# EAGLE design LED_Board (EAGLE 7.6.0)
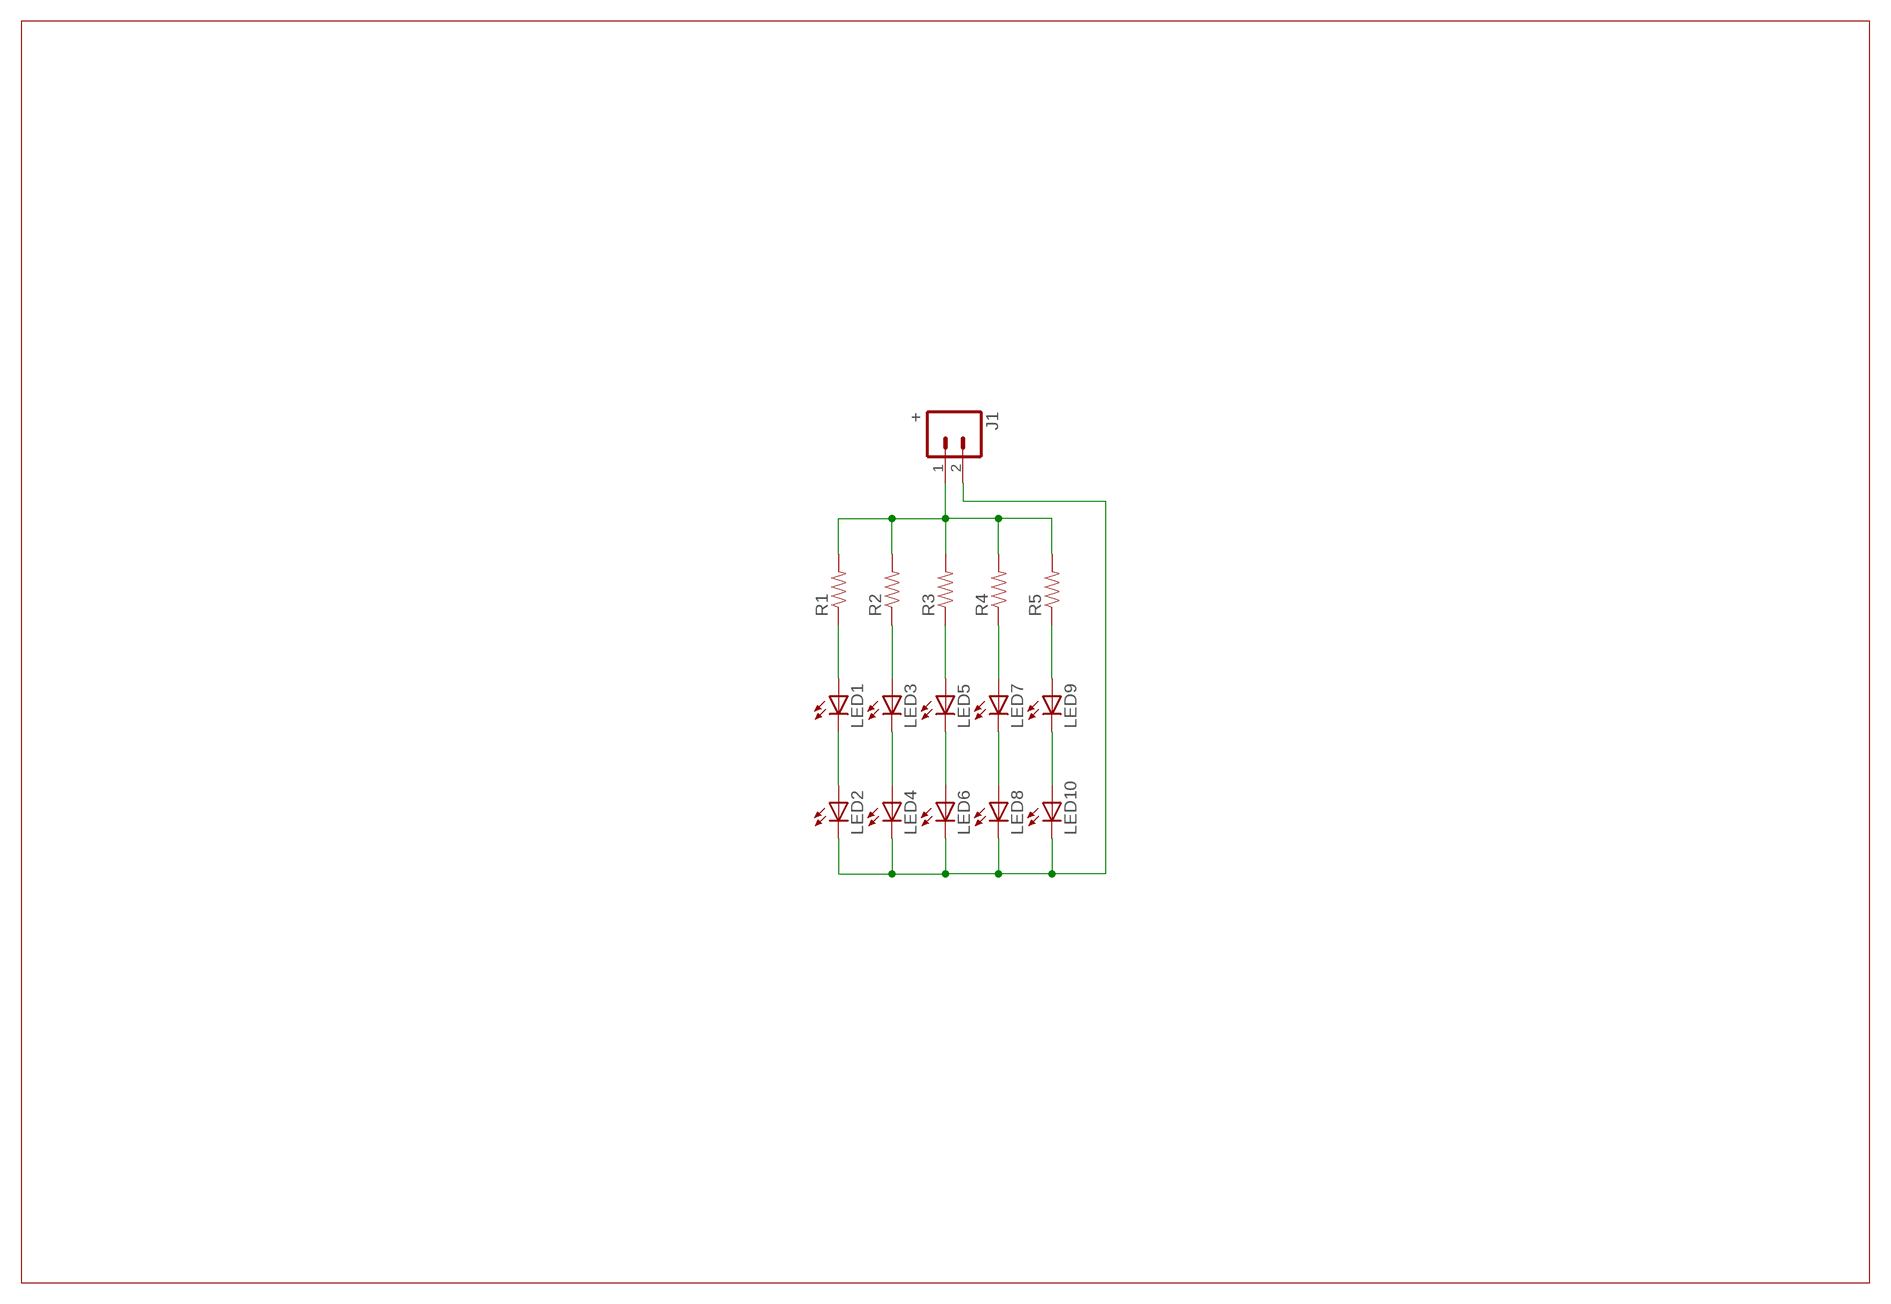
[diagram p0: schematic, sheet 1]

## Parts
J1  +  M02LOCK  [1X02_LOCK]
LED1  LED5MM  [LED5MM]
LED2  LED5MM  [LED5MM]
LED3  LED5MM  [LED5MM]
LED4  LED5MM  [LED5MM]
LED5  LED5MM  [LED5MM]
LED6  LED5MM  [LED5MM]
LED7  LED5MM  [LED5MM]
LED8  LED5MM  [LED5MM]
LED9  LED5MM  [LED5MM]
LED10  LED5MM  [LED5MM]
R1  RESISTOR1206  [1206]
R2  RESISTOR1206  [1206]
R3  RESISTOR1206  [1206]
R4  RESISTOR1206  [1206]
R5  RESISTOR1206  [1206]

## Nets
GND: J1.2 LED2.K(C) LED4.K(C) LED6.K(C) LED8.K(C) LED10.K(C)
N$1: J1.1 R1.2 R2.2 R3.2 R4.2 R5.2
N$4: LED9.A R5.1
N$5: LED7.A R4.1
N$6: LED5.A R3.1
N$7: LED3.A R2.1
N$8: LED1.A R1.1
N$9: LED1.K(C) LED2.A
N$10: LED3.K(C) LED4.A
N$11: LED5.K(C) LED6.A
N$12: LED7.K(C) LED8.A
N$13: LED9.K(C) LED10.A

## Library data of the parts
J1 = Connectors:M02: Standard 2-pin 0.1" header. Use with - straight break away headers ( PRT-00116) - right angle break away headers (PRT-00553) - swiss pins (PRT-00743) - machine pins (PRT-00117) - female headers (PRT-00115) Molex polarized connector foot print use with: PRT-08233 with associated crimp pins and housings. 2.54_SCREWTERM for use with PRT-10571. 3.5mm Screw Terminal footprints for PRT-08084 5mm Screw Terminal footprints for use with PRT-08432
LED1-LED10 = led:LED: LED OSRAM: - CHIPLED LG R971, LG N971, LY N971, LG Q971, LY Q971, LO R971, LY R971 LH N974, LH R974 LS Q976, LO Q976, LY Q976 LO Q996 - Hyper CHIPLED LW Q18S LB Q993, LB Q99A, LB R99A - SideLED LS A670, LO A670, LY A670, LG A670, LP A670 LB A673, LV A673, LT A673, LW A673 LH A674 LY A675 LS A676, LA A676, LO A676, LY A676, LW A676 LS A679, LY A679, LG A679 - Hyper Micro SIDELED® LS Y876, LA Y876, LO Y876, LY Y876 LT Y87S - SmartLED LW L88C, LW L88S LB L89C, LB L89S, LG L890 LS L89K, LO L89K, LY L89K LS L896, LA L896, LO L896, LY L896 - TOPLED LS T670, LO T670, LY T670, LG T670, LP T670 LSG T670, LSP T670, LSY T670, LOP T670, LYG T670 LG T671, LOG T671, LSG T671 LB T673, LV T673, LT T673, LW T673 LH T674 LS T676, LA T676, LO T676, LY T676, LB T676, LH T676, LSB T676, LW T676 LB T67C, LV T67C, LT T67C, LS T67K, LO T67K, LY T67K, LW E67C LS E67B, LA E67B, LO E67B, LY E67B, LB E67C, LV E67C, LT E67C LW T67C LS T679, LY T679, LG T679 LS T770, LO T770, LY T770, LG T770, LP T770 LB T773, LV T773, LT T773, LW T773 LH T774 LS E675, LA E675, LY E675, LS T675 LS T776, LA T776, LO T776, LY T776, LB T776 LHGB T686 LT T68C, LB T68C - Hyper Mini TOPLED® LB M676 - Mini TOPLED Santana® LG M470 LS M47K, LO M47K, LY M47K Source: http://www.osram.convergy.de LUXEON: - LUMILED® LXK2-PW12-R00, LXK2-PW12-S00, LXK2-PW14-U00, LXK2-PW14-V00 LXK2-PM12-R00, LXK2-PM12-S00, LXK2-PM14-U00 LXK2-PE12-Q00, LXK2-PE12-R00, LXK2-PE12-S00, LXK2-PE14-T00, LXK2-PE14-U00 LXK2-PB12-K00, LXK2-PB12-L00, LXK2-PB12-M00, LXK2-PB14-N00, LXK2-PB14-P00, LXK2-PB14-Q00 LXK2-PR12-L00, LXK2-PR12-M00, LXK2-PR14-Q00, LXK2-PR14-R00 LXK2-PD12-Q00, LXK2-PD12-R00, LXK2-PD12-S00 LXK2-PH12-R00, LXK2-PH12-S00 LXK2-PL12-P00, LXK2-PL12-Q00, LXK2-PL12-R00 Source: www.luxeon.com KINGBRIGHT: KA-3528ASYC Source: www.kingbright.com
R1-R5 = Passives:RESISTOR: Resistor Basic schematic elements and footprints for 0603, 1206, and PTH resistors.

## Board
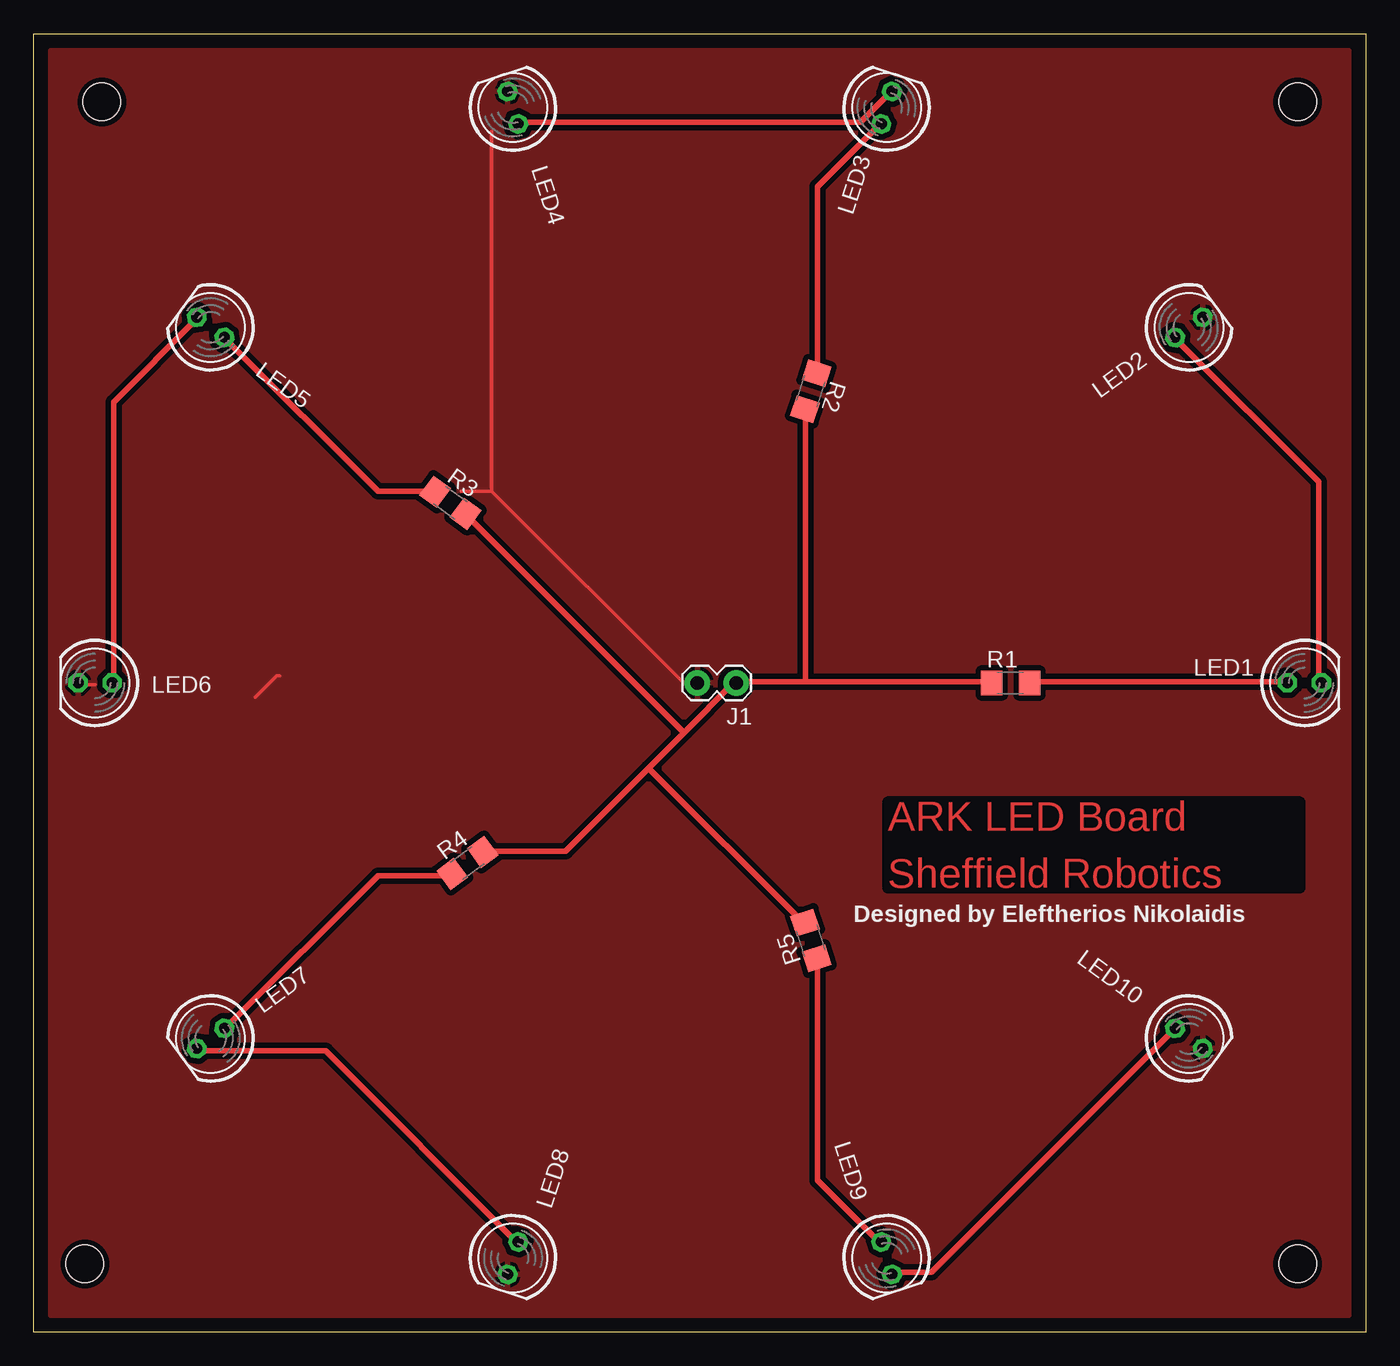
[diagram p1: board, top side]

Size 99.06 x 96.52 mm. Coordinates in mm from the lower left corner, seen from the top.
Outline: 0,96.52 99.06,96.52 99.06,0 0,0 0,96.52
Copper layers (1*16): Top 0.035mm / dielectric 1.5mm / Bottom 0.035mm
Design rules "SparkFun": minimum track width 8mil, minimum drill 20mil, track to track 8mil, track to pad 8mil, pad to pad 8mil, via to via 8mil, smd to smd 8mil, copper to edge 10mil, drill to drill 8mil, minimum pad ring 12mil, minimum via ring 10mil, stop-mask expansion 4mil, vias tented up to drill 25mil, thermal gap 10mil
Holes 2.8 mm at 5.08,91.44 93.98,91.44 93.98,5.08 3.81,5.08

### Footprints (pad centres in the part's own frame; a part is rotated, then mirrored left to right if it is on the bottom)
1X02_LOCK = drill 1.016 pad 1.88: 1 -0.178,0; 2 2.718,0
LED5MM = drill 0.813 octagon: A -1.27,0; K 1.27,0
1206 = smd 1.6 x 1.8: 1 -1.4,0; 2 1.4,0

### Placement (x,y rotation side)
J1  52.07,48.26 180 top
LED1  94.49,48.26 0 top
LED2  85.9,74.69 36 top
LED3  63.42,91.02 72 top
LED4  35.64,91.02 108 top
LED5  13.16,74.69 144 top
LED6  4.57,48.26 180 top
LED7  13.16,21.83 216 top
LED8  35.64,5.5 252 top
LED9  63.42,5.5 288 top
LED10  85.9,21.83 324 top
R1  72.64,48.26 180 top
R2  57.78,69.94 252 top
R3  30.99,61.64 324 top
R4  32.26,34.88 36 top
R5  57.78,29.12 108 top

### Tracks (layer width: path | path; a pad name or v marks a point on that pad's centre or on a via)
GND
  Top 0.254: 4.57,48.11 3.43,48.11 LED6.K | 16.46,47.19 18.06,48.79 18.29,48.79 | 34.06,62.51 31.77,62.51 | 34.06,62.51 48.23,48.34 J1.2 | 34.06,62.51 34.06,89.26 | 35.2,92 LED4.K
  pour Top (isolate 0.406): 1.27,95.25 1.27,1.27 81.28,1.27 97.79,1.27 97.79,95.25
N$1
  Top 0.406: 48.46,44.68 51.89,48.11 J1.1 52.12,48.34 57.38,48.34 | 48.46,44.68 45.72,41.94 | 45.72,41.94 39.55,35.76 33.6,35.76 R4.2 | 45.72,41.94 57.15,30.5 57.35,30.5 R5.2 | 48.46,44.68 48.23,44.68 32.23,60.68 R3.2 | 57.38,48.34 71.09,48.34 R1.2 | 57.38,48.34 57.38,68.45 R2.2
N$4
  Top 0.406: R5.1 58.29,27.76 58.29,11.3 62.87,6.73 LED9.A
N$5
  Top 0.406: R4.1 31.09,33.93 25.6,33.93 14.4,22.73 LED7.A
N$6
  Top 0.406: R3.1 29.72,62.51 25.6,62.51 14.4,73.71 LED5.A
N$7
  Top 0.406: R2.1 58.29,71.42 58.29,85.14 62.87,89.71 LED3.A
N$8
  Top 0.406: R1.1 74.07,48.34 93.04,48.34 LED1.A
N$9
  Top 0.406: LED1.K 95.56,48.34 95.56,63.19 85.04,73.71 LED2.A
N$10
  Top 0.406: LED4.A 36.12,89.94 61.49,89.94 63.78,92.23 LED3.K
N$11
  Top 0.406: LED6.A 5.94,48.34 5.94,69.14 12.12,75.31 LED5.K
N$12
  Top 0.406: LED7.K 12.34,20.9 21.72,20.9 35.89,6.73 LED8.A
N$13
  Top 0.406: LED9.K 64.01,4.45 66.75,4.45 84.81,22.5 LED10.A

### Text on the board
Top: ARK LED Board / Sheffield Robotics
tPlace: Designed by Eleftherios Nikolaidis